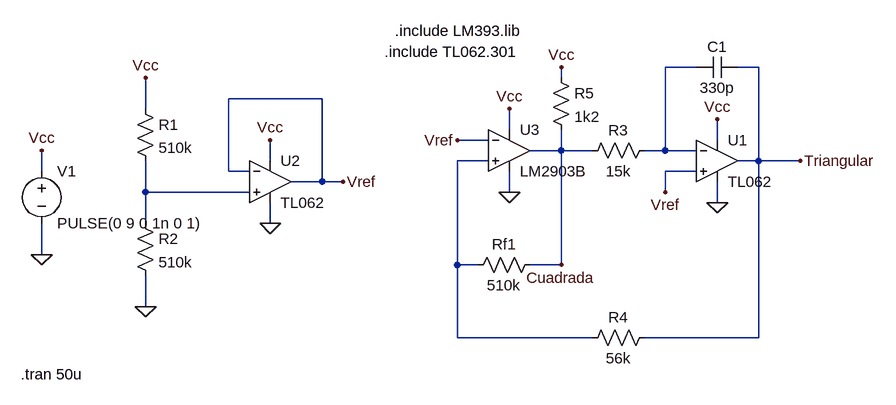
[diagram p0: schematic Oscilador.asc]
Oscilador.asc, the LTspice schematic file:
Version 4
SHEET 1 880 816
WIRE 48 16 0 16
WIRE 144 16 112 16
WIRE -160 32 -160 16
WIRE -528 64 -672 64
WIRE -800 80 -800 32
WIRE -240 112 -240 80
WIRE -272 128 -320 128
WIRE 80 128 80 96
WIRE -160 144 -160 112
WIRE -160 144 -208 144
WIRE -112 144 -160 144
WIRE 0 144 0 16
WIRE 0 144 -32 144
WIRE 48 144 0 144
WIRE -608 160 -608 128
WIRE -272 160 -320 160
WIRE 144 160 144 16
WIRE 144 160 112 160
WIRE 208 160 144 160
WIRE -960 176 -960 144
WIRE -672 176 -672 64
WIRE -640 176 -672 176
WIRE 48 176 0 176
WIRE -528 192 -528 64
WIRE -528 192 -576 192
WIRE -496 192 -528 192
WIRE -800 208 -800 160
WIRE -640 208 -800 208
WIRE -240 208 -240 176
WIRE 0 208 0 176
WIRE 80 224 80 192
WIRE -800 256 -800 208
WIRE -608 256 -608 224
WIRE -960 304 -960 256
WIRE -320 320 -320 160
WIRE -288 320 -320 320
WIRE -160 320 -160 144
WIRE -160 320 -208 320
WIRE -800 384 -800 336
WIRE -320 432 -320 320
WIRE -112 432 -320 432
WIRE 144 432 144 160
WIRE 144 432 -32 432
FLAG -960 304 0
FLAG -960 144 Vcc
FLAG -240 208 0
FLAG 80 224 0
FLAG -608 128 Vcc
FLAG -608 256 0
FLAG -800 384 0
FLAG -800 32 Vcc
FLAG -496 192 Vref
FLAG -240 80 Vcc
FLAG 80 96 Vcc
FLAG -320 128 Vref
FLAG 0 208 Vref
FLAG -160 320 Cuadrada
FLAG 208 160 Triangular
FLAG -160 16 Vcc
SYMBOL voltage -960 160 R0
WINDOW 123 0 0 Left 0
WINDOW 39 0 0 Left 0
SYMATTR InstName V1
SYMATTR Value PULSE(0 9 0 1n 0 1)
SYMBOL res -816 64 R0
SYMATTR InstName R1
SYMATTR Value 510k
SYMBOL res -816 240 R0
SYMATTR InstName R2
SYMATTR Value 510k
SYMBOL res -192 304 R90
WINDOW 0 0 56 VBottom 2
WINDOW 3 32 56 VTop 2
SYMATTR InstName Rf1
SYMATTR Value 510k
SYMBOL res -16 128 R90
WINDOW 0 0 56 VBottom 2
WINDOW 3 32 56 VTop 2
SYMATTR InstName R3
SYMATTR Value 15k
SYMBOL cap 112 0 R90
WINDOW 0 0 32 VBottom 2
WINDOW 3 32 32 VTop 2
SYMATTR InstName C1
SYMATTR Value 330p
SYMBOL res -16 416 R90
WINDOW 0 0 56 VBottom 2
WINDOW 3 32 56 VTop 2
SYMATTR InstName R4
SYMATTR Value 56k
SYMBOL res -176 16 R0
SYMATTR InstName R5
SYMATTR Value 1k2
SYMBOL OpAmps\\opamp2 -240 80 R0
SYMATTR InstName U3
SYMATTR Value LM2903B
SYMBOL OpAmps\\opamp2 80 96 R0
SYMATTR InstName U1
SYMATTR Value TL062
SYMBOL OpAmps\\opamp2 -608 128 R0
SYMATTR InstName U2
SYMATTR Value TL062
TEXT -992 488 Left 2 !.tran 50u
TEXT -416 -40 Left 2 !.include LM393.lib
TEXT -432 -8 Left 2 !.include TL062.301

The netlist it stands for:
* Oscilador.asc
V1 Vcc 0 PULSE(0 9 0 1n 0 1)
R1 Vcc N003 510k
R2 N003 0 510k
Rf1 Cuadrada N002 510k
R3 N001 Cuadrada 15k
C1 Triangular N001 330p
R4 Triangular N002 56k
R5 Vcc Cuadrada 1k2
XU3 N002 Vref Vcc 0 Cuadrada LM2903B  ; pins In+ In- V+ V- OUT
XU1 Vref N001 Vcc 0 Triangular TL062  ; pins In+ In- V+ V- OUT
XU2 N003 Vref Vcc 0 Vref TL062  ; pins In+ In- V+ V- OUT
.tran 50u
.include LM393.lib
.include TL062.301
.backanno
.end